# EAGLE design Sensor Bar (EAGLE 6.1)
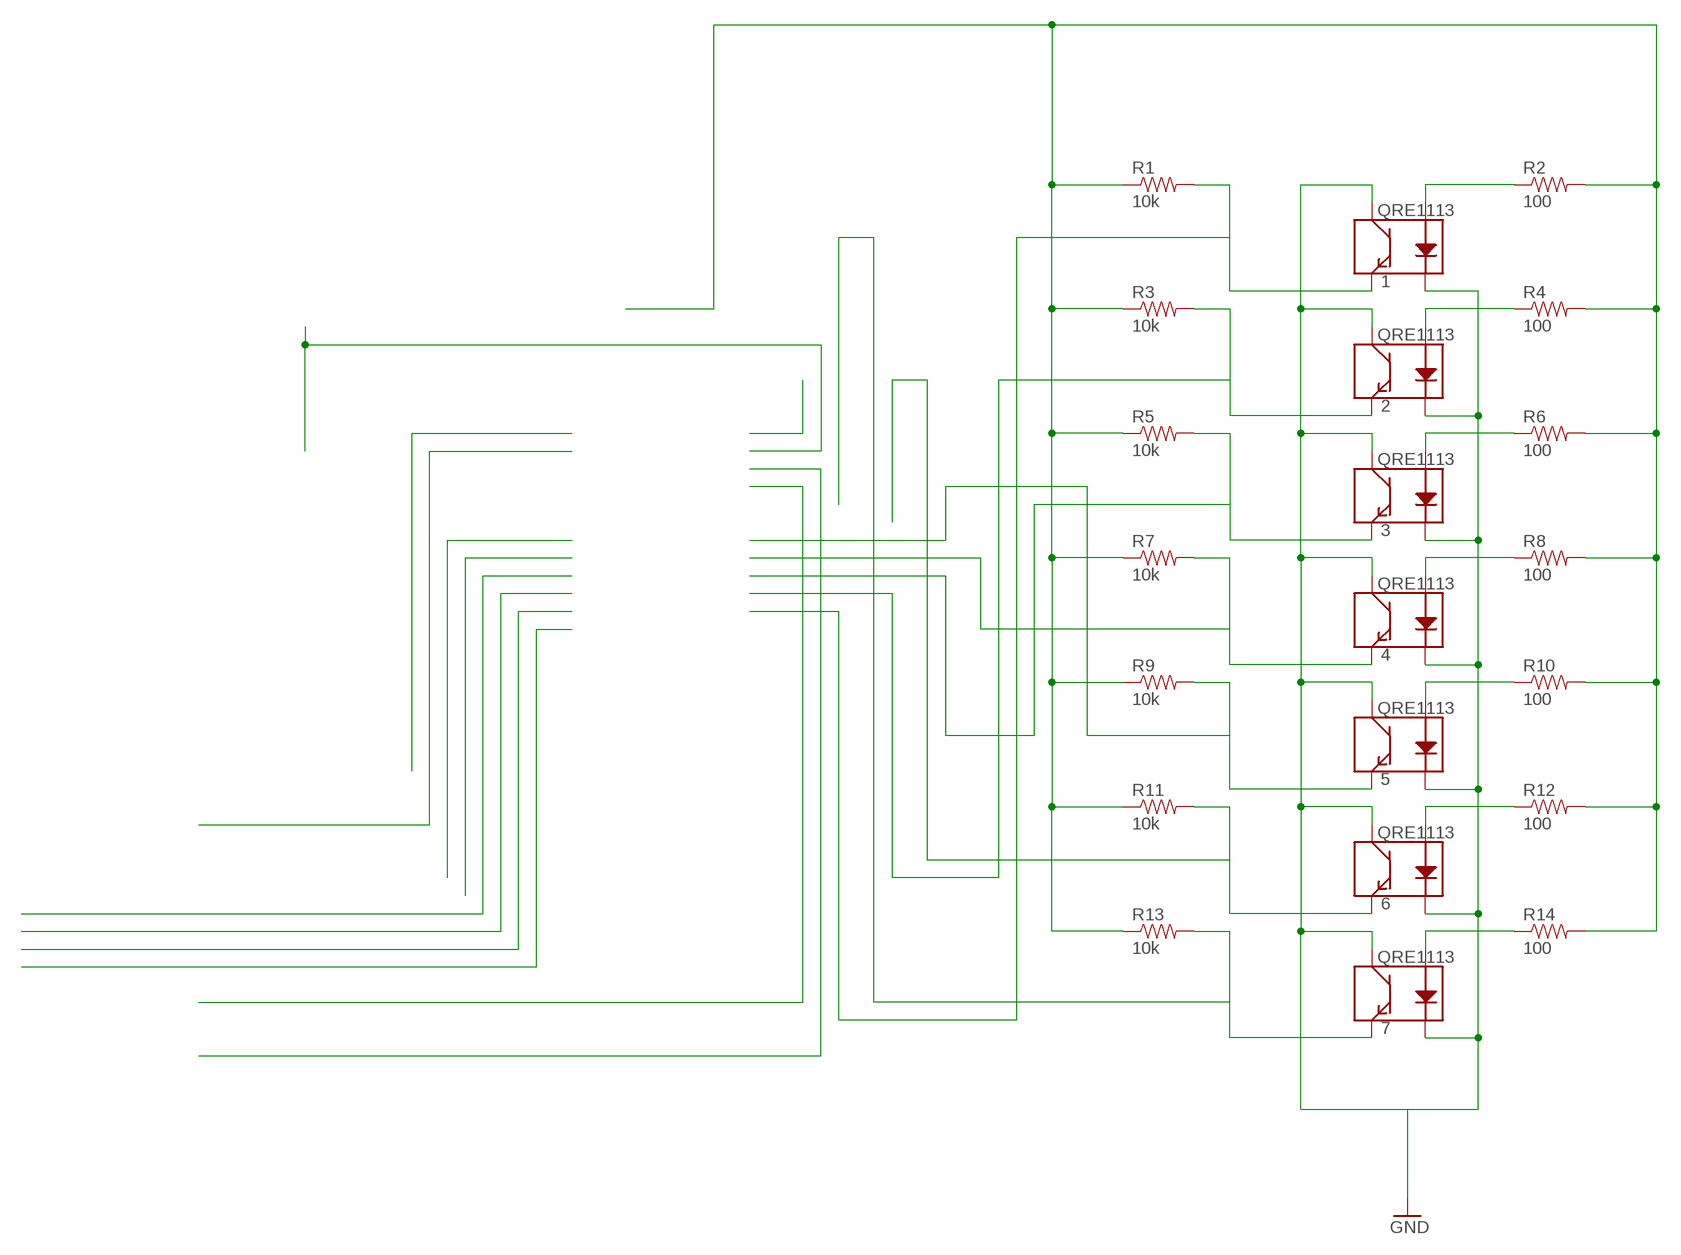
[diagram p0: schematic, sheet 1]

## Parts
1  QRE1113  [QRE1113]
2  QRE1113  [QRE1113]
3  QRE1113  [QRE1113]
4  QRE1113  [QRE1113]
5  QRE1113  [QRE1113]
6  QRE1113  [QRE1113]
7  QRE1113  [QRE1113]
R1  10k  RESISTOR0603-RES  [0603-RES]
R2  100  RESISTOR0805-RES  [0805]
R3  10k  RESISTOR0603-RES  [0603-RES]
R4  100  RESISTOR0805-RES  [0805]
R5  10k  RESISTOR0603-RES  [0603-RES]
R6  100  RESISTOR0805-RES  [0805]
R7  10k  RESISTOR0603-RES  [0603-RES]
R8  100  RESISTOR0805-RES  [0805]
R9  10k  RESISTOR0603-RES  [0603-RES]
R10  100  RESISTOR0805-RES  [0805]
R11  10k  RESISTOR0603-RES  [0603-RES]
R12  100  RESISTOR0805-RES  [0805]
R13  10k  RESISTOR0603-RES  [0603-RES]
R14  100  RESISTOR0805-RES  [0805]

## Nets
GND: 1.2(K) 1.3(C) 2.2(K) 2.3(C) 3.2(K) 3.3(C) 4.2(K) 4.3(C) 5.2(K) 5.3(C) 6.2(K) 6.3(C) 7.2(K) 7.3(C)
N$2: 2.4(E) R3.2
N$3: 3.4(E) R5.2
N$4: 4.4(E) R7.2
N$8: 1.1(A) R2.1
N$9: 2.1(A) R4.1
N$10: 3.1(A) R6.1
N$11: 4.1(A) R8.1
N$12: 5.1(A) R10.1
N$13: 6.1(A) R12.1
N$14: 7.1(A) R14.1
N$15: R1.1 R2.2 R3.1 R4.2 R5.1 R6.2 R7.1 R8.2 R9.1 R10.2 R11.1 R12.2 R13.1 R14.2
N$21: 1.4(E) R1.2
N$24: 5.4(E) R9.2
N$29: 6.4(E) R11.2
N$33: 7.4(E) R13.2

## Library data of the parts
1-7 = SparkFun:QRE1113
R1-R14 = SparkFun:RESISTOR: Resistor Basic schematic elements and footprints for 0603, 1206, and PTH resistors.

## Board
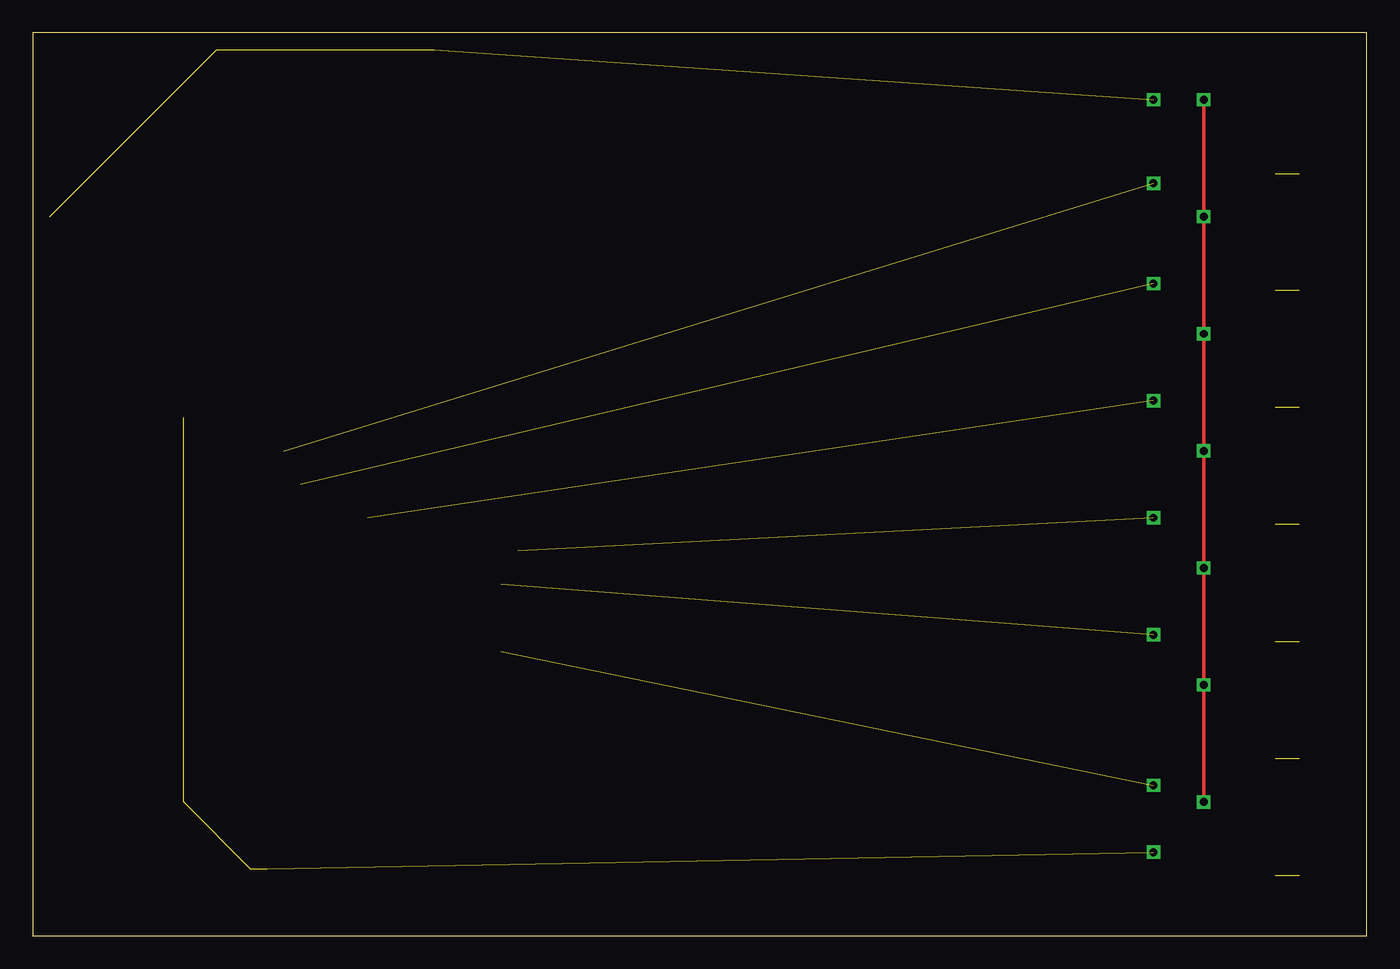
[diagram p1: board, top side]
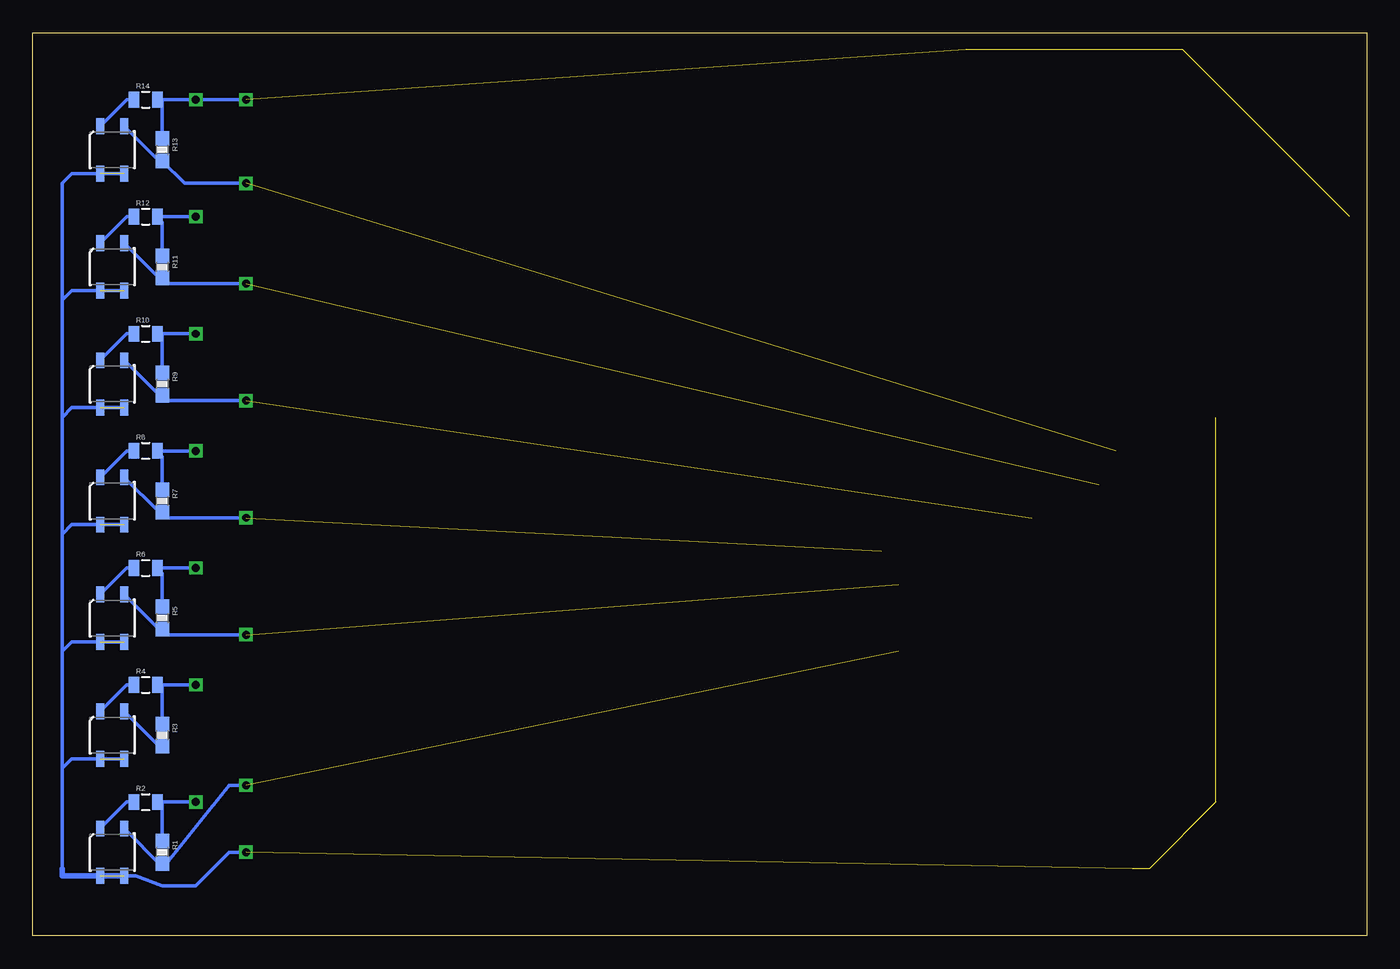
[diagram p2: board, bottom side, seen from below]

Size 101.27 x 68.57 mm. Coordinates in mm from the lower left corner, seen from the top.
Outline: 0,0 101.27,0 101.27,68.57 0,68.57 0,0
Copper layers (1*16): Top 0.035mm / dielectric 1.5mm / Bottom 0.035mm
Design rules: minimum track width 10mil, minimum drill 24mil, track to track 8mil, track to pad 8mil, pad to pad 8mil, via to via 8mil, smd to smd 8mil, copper to edge 40mil, drill to drill 8mil, minimum pad ring 10mil, minimum via ring 8mil, stop-mask expansion 4mil, vias tented up to drill 0mil, thermal gap 10mil

### Footprints (pad centres in the part's own frame; a part is rotated, then mirrored left to right if it is on the bottom)
QRE1113 = smd 1.2 x 0.6: 1 -1.8,-0.9; 2 1.8,-0.9; 3 1.8,0.9; 4 -1.8,0.9
0603-RES = smd 1.1 x 1: 1 -0.85,0; 2 0.85,0
0805 = smd 0.8 x 1.2: 1 -0.9,0; 2 0.9,0

### Placement (x,y rotation side)
1  95.25,6.35 270 bottom
2  95.25,15.24 270 bottom
3  95.25,24.13 270 bottom
4  95.25,33.02 270 bottom
5  95.25,41.91 270 bottom
6  95.25,50.8 270 bottom
7  95.25,59.69 270 bottom
R1  91.44,6.35 270 bottom
R2  92.71,10.16 0 bottom
R3  91.44,15.24 270 bottom
R4  92.71,19.05 0 bottom
R5  91.44,24.13 270 bottom
R6  92.71,27.94 0 bottom
R7  91.44,33.02 270 bottom
R8  92.71,36.83 0 bottom
R9  91.44,41.91 270 bottom
R10  92.71,45.72 0 bottom
R11  91.44,50.8 270 bottom
R12  92.71,54.61 0 bottom
R13  91.44,59.69 270 bottom
R14  92.71,63.5 0 bottom

### Tracks (layer width: path | path; a pad name or v marks a point on that pad's centre or on a via)
GND  (via drill 0.6)  (11 unrouted)
  Bottom 0.254: 7.3 98.32,57.89 99.06,57.15 99.06,48.26 | 99.06,48.26 99.06,39.37 | 99.06,39.37 99.06,30.48 | 99.06,30.48 99.06,21.59 | 99.06,21.59 99.06,12.7 | 99.06,12.7 99.06,5.08 | 2.3 98.32,13.44 99.06,12.7 | 3.3 98.32,22.33 99.06,21.59 | 4.3 98.32,31.22 99.06,30.48 | 5.3 98.32,40.11 99.06,39.37 | 6.3 98.32,49 99.06,48.26 | 1.3 93.45,4.55 91.44,3.81 88.9,3.81 86.36,6.35 v85.09,6.35
  Bottom 0.406: 1.3 99.06,4.55 99.06,5.08
N$2
  Bottom 0.254: 2.4 91.7,14.39 R3.2 91.02,13.97
N$3  (via drill 0.6)  (1 unrouted)
  Bottom 0.254: 3.4 91.7,23.28 R5.2 91.02,22.86 v85.09,22.86
N$4  (via drill 0.6)  (1 unrouted)
  Bottom 0.254: 4.4 91.7,32.17 R7.2 91.44,31.75 v85.09,31.75
N$8
  Bottom 0.254: R2.1 94.14,10.16 1.1
N$9
  Bottom 0.254: R4.1 94.14,19.05 2.1
N$10
  Bottom 0.254: R6.1 94.14,27.94 3.1
N$11
  Bottom 0.254: R8.1 94.14,36.83 4.1
N$12
  Bottom 0.254: R10.1 94.14,45.72 5.1
N$13
  Bottom 0.254: R12.1 94.14,54.61 6.1
N$14
  Bottom 0.254: R14.1 94.14,63.5 7.1
N$15  (via drill 0.6)  (3 unrouted)
  Top 0.254: v88.9,10.16 v88.9,19.05 v88.9,27.94 v88.9,36.83 v88.9,45.72 v88.9,54.61 v88.9,63.5
  Bottom 0.254: 91.44,10.16 R1.1 | 91.44,10.16 R2.2 | 91.44,63.5 v88.9,63.5 v85.09,63.5 | v88.9,54.61 R12.2 91.44,54.19 R11.1 | R10.2 91.44,45.72 | 91.44,45.72 v88.9,45.72 | R9.1 91.44,45.72 | v88.9,36.83 R8.2 91.44,36.41 R7.1 | v88.9,27.94 R6.2 91.44,27.52 R5.1 | R4.2 91.44,19.05 | 91.44,19.05 v88.9,19.05 | R3.1 91.44,19.05 | 91.44,10.16 v88.9,10.16 | R13.1 91.44,63.5 | 91.44,63.5 R14.2
N$21  (via drill 0.6)  (1 unrouted)
  Bottom 0.254: 91.44,5.24 R1.2 | 91.44,5.24 91.44,5.08 86.36,11.43 v85.09,11.43 | 91.44,5.24 1.4
N$24  (via drill 0.6)  (1 unrouted)
  Bottom 0.254: 5.4 91.7,41.06 R9.2 91.44,40.64 v85.09,40.64
N$29  (via drill 0.6)  (1 unrouted)
  Bottom 0.254: 6.4 91.7,49.95 R11.2 91.44,49.53 v85.09,49.53
N$33  (via drill 0.6)  (1 unrouted)
  Bottom 0.254: R13.2 91.7,58.84 7.4 | 91.02,58.42 R13.2 | v85.09,57.15 89.75,57.15 R13.2